# Altium schematic sheet BloopPadMaxx_01.SchDoc: BloopPad Maxx
size A3; Date: 11/09/2026; DrawnBy: Wim Van Gool; DocumentNumber: 1; Revision: 01; SheetNumber: 1; SheetTotal: 1
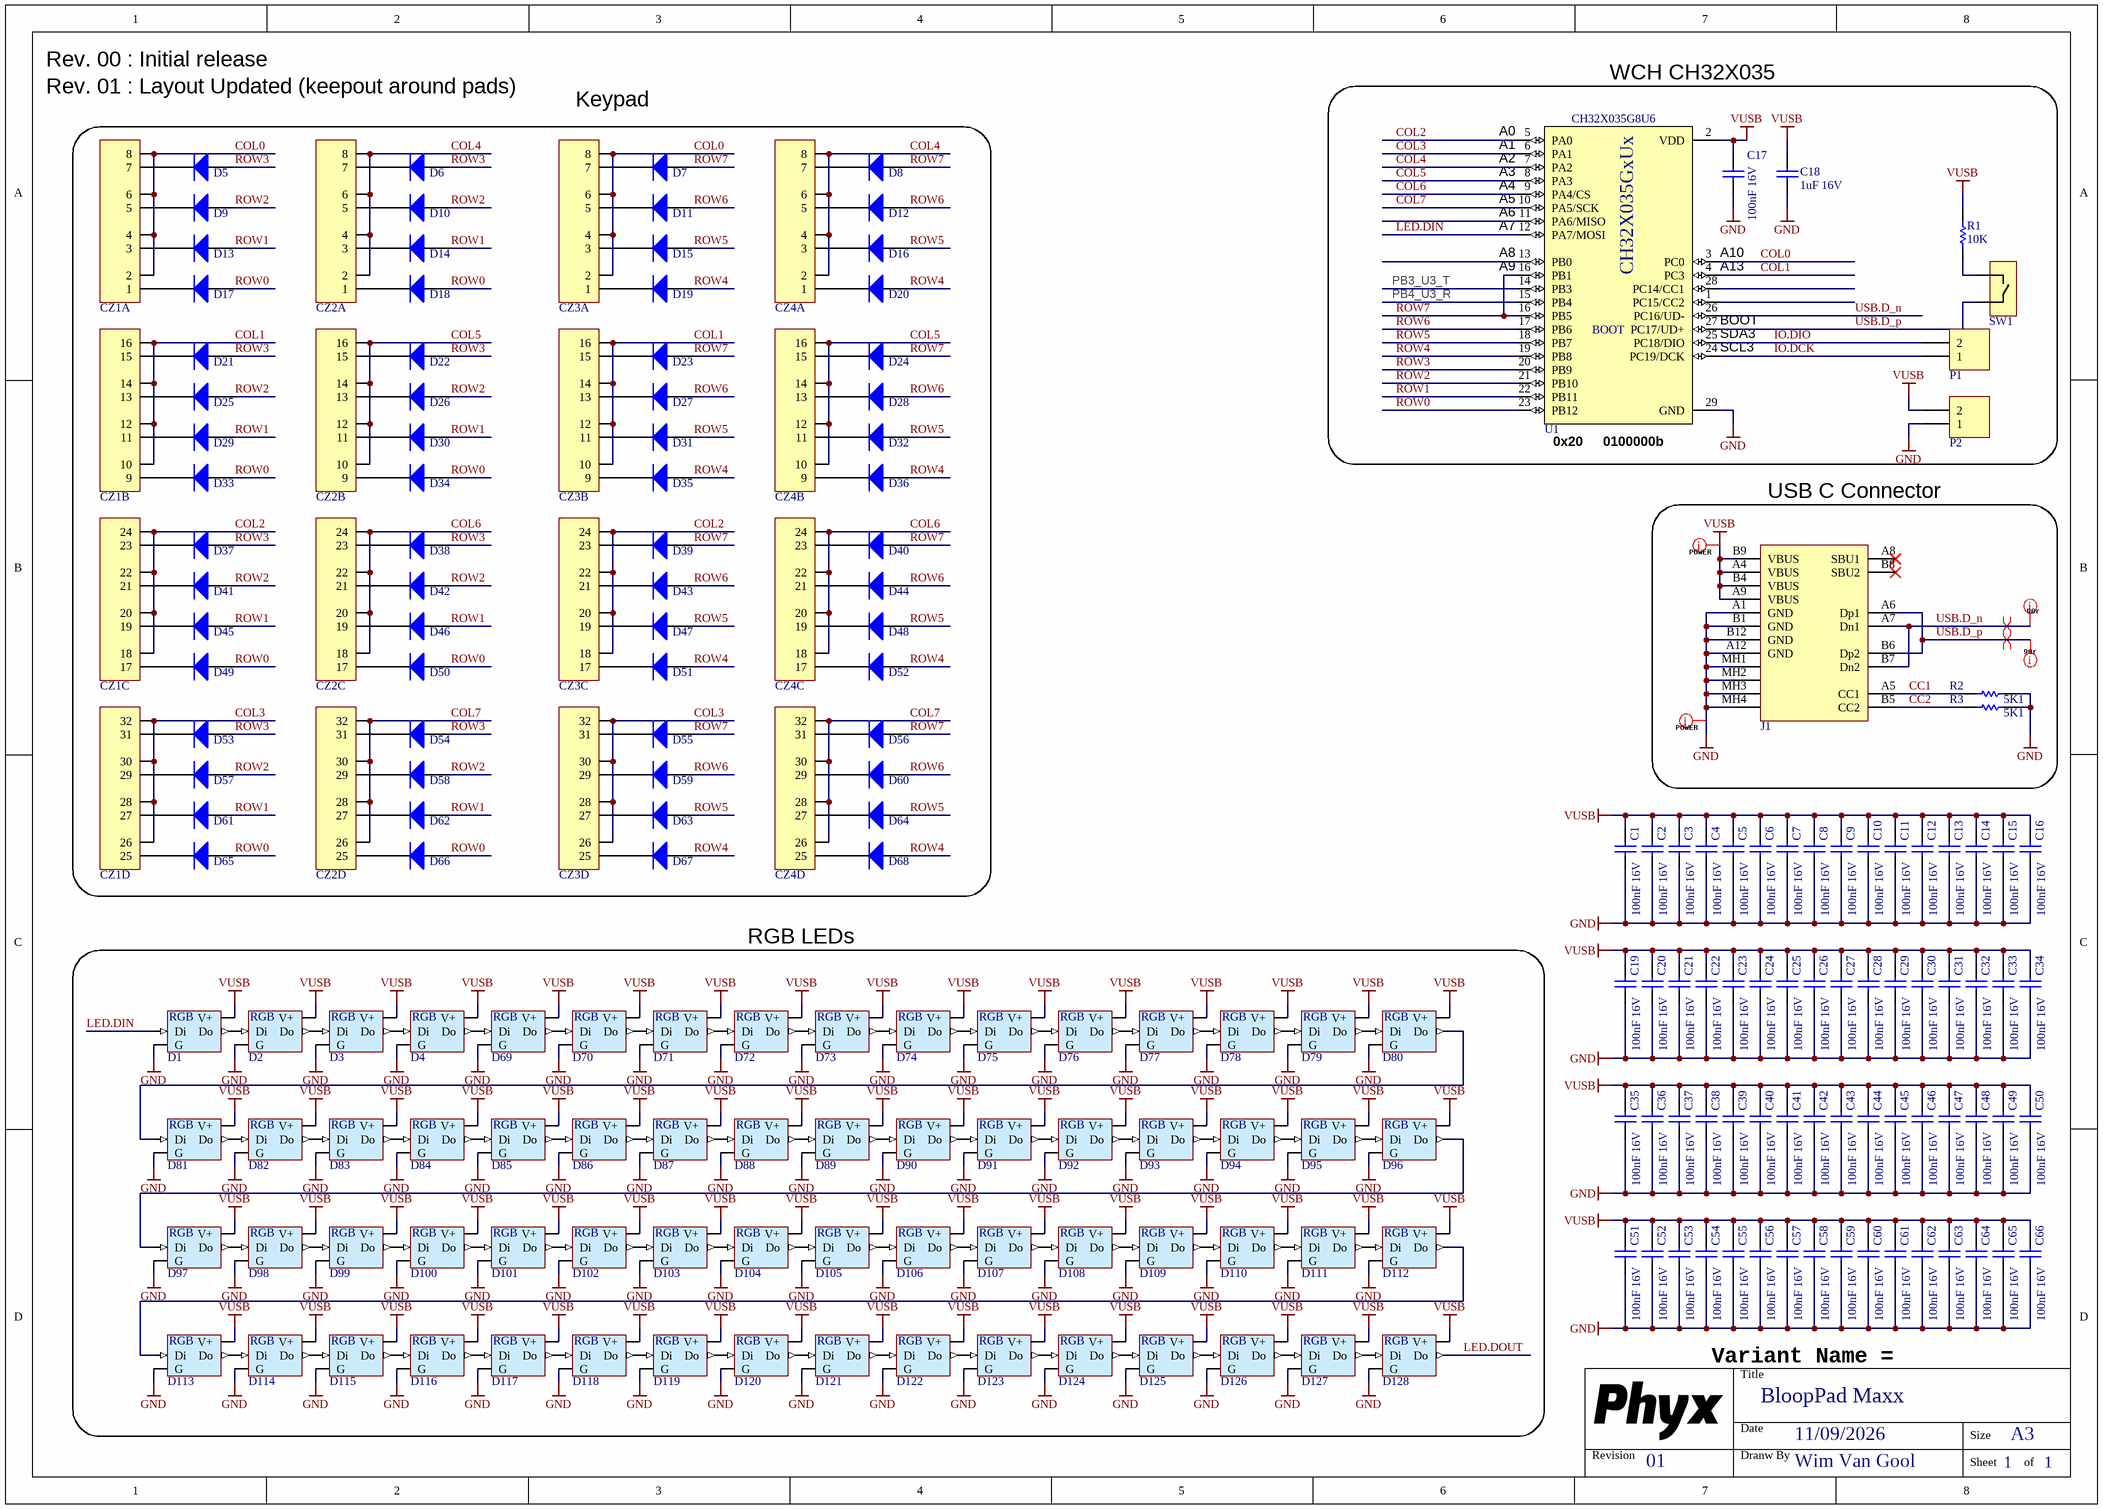
[diagram p0: BloopPadMaxx_01.SchDoc]

## Parts
C1  value 100nF 16V  [C0603_N]  (hidden comment: CAP_CERAMIC)
C2  value 100nF 16V  [C0603_N]  (hidden comment: CAP_CERAMIC)
C3  value 100nF 16V  [C0603_N]  (hidden comment: CAP_CERAMIC)
C4  value 100nF 16V  [C0603_N]  (hidden comment: CAP_CERAMIC)
C5  value 100nF 16V  [C0603_N]  (hidden comment: CAP_CERAMIC)
C6  value 100nF 16V  [C0603_N]  (hidden comment: CAP_CERAMIC)
C7  value 100nF 16V  [C0603_N]  (hidden comment: CAP_CERAMIC)
C8  value 100nF 16V  [C0603_N]  (hidden comment: CAP_CERAMIC)
C9  value 100nF 16V  [C0603_N]  (hidden comment: CAP_CERAMIC)
C10  value 100nF 16V  [C0603_N]  (hidden comment: CAP_CERAMIC)
C11  value 100nF 16V  [C0603_N]  (hidden comment: CAP_CERAMIC)
C12  value 100nF 16V  [C0603_N]  (hidden comment: CAP_CERAMIC)
C13  value 100nF 16V  [C0603_N]  (hidden comment: CAP_CERAMIC)
C14  value 100nF 16V  [C0603_N]  (hidden comment: CAP_CERAMIC)
C15  value 100nF 16V  [C0603_N]  (hidden comment: CAP_CERAMIC)
C16  value 100nF 16V  [C0603_N]  (hidden comment: CAP_CERAMIC)
C17  value 100nF 16V  [C0603_N]
C18  value 1uF 16V  [C0603_N]
C19  value 100nF 16V  [C0603_N]  (hidden comment: CAP_CERAMIC)
C20  value 100nF 16V  [C0603_N]  (hidden comment: CAP_CERAMIC)
C21  value 100nF 16V  [C0603_N]  (hidden comment: CAP_CERAMIC)
C22  value 100nF 16V  [C0603_N]  (hidden comment: CAP_CERAMIC)
C23  value 100nF 16V  [C0603_N]  (hidden comment: CAP_CERAMIC)
C24  value 100nF 16V  [C0603_N]  (hidden comment: CAP_CERAMIC)
C25  value 100nF 16V  [C0603_N]  (hidden comment: CAP_CERAMIC)
C26  value 100nF 16V  [C0603_N]  (hidden comment: CAP_CERAMIC)
C27  value 100nF 16V  [C0603_N]  (hidden comment: CAP_CERAMIC)
C28  value 100nF 16V  [C0603_N]  (hidden comment: CAP_CERAMIC)
C29  value 100nF 16V  [C0603_N]  (hidden comment: CAP_CERAMIC)
C30  value 100nF 16V  [C0603_N]  (hidden comment: CAP_CERAMIC)
C31  value 100nF 16V  [C0603_N]  (hidden comment: CAP_CERAMIC)
C32  value 100nF 16V  [C0603_N]  (hidden comment: CAP_CERAMIC)
C33  value 100nF 16V  [C0603_N]  (hidden comment: CAP_CERAMIC)
C34  value 100nF 16V  [C0603_N]  (hidden comment: CAP_CERAMIC)
C35  value 100nF 16V  [C0603_N]  (hidden comment: CAP_CERAMIC)
C36  value 100nF 16V  [C0603_N]  (hidden comment: CAP_CERAMIC)
C37  value 100nF 16V  [C0603_N]  (hidden comment: CAP_CERAMIC)
C38  value 100nF 16V  [C0603_N]  (hidden comment: CAP_CERAMIC)
C39  value 100nF 16V  [C0603_N]  (hidden comment: CAP_CERAMIC)
C40  value 100nF 16V  [C0603_N]  (hidden comment: CAP_CERAMIC)
C41  value 100nF 16V  [C0603_N]  (hidden comment: CAP_CERAMIC)
C42  value 100nF 16V  [C0603_N]  (hidden comment: CAP_CERAMIC)
C43  value 100nF 16V  [C0603_N]  (hidden comment: CAP_CERAMIC)
C44  value 100nF 16V  [C0603_N]  (hidden comment: CAP_CERAMIC)
C45  value 100nF 16V  [C0603_N]  (hidden comment: CAP_CERAMIC)
C46  value 100nF 16V  [C0603_N]  (hidden comment: CAP_CERAMIC)
C47  value 100nF 16V  [C0603_N]  (hidden comment: CAP_CERAMIC)
C48  value 100nF 16V  [C0603_N]  (hidden comment: CAP_CERAMIC)
C49  value 100nF 16V  [C0603_N]  (hidden comment: CAP_CERAMIC)
C50  value 100nF 16V  [C0603_N]  (hidden comment: CAP_CERAMIC)
C51  value 100nF 16V  [C0603_N]  (hidden comment: CAP_CERAMIC)
C52  value 100nF 16V  [C0603_N]  (hidden comment: CAP_CERAMIC)
C53  value 100nF 16V  [C0603_N]  (hidden comment: CAP_CERAMIC)
C54  value 100nF 16V  [C0603_N]  (hidden comment: CAP_CERAMIC)
C55  value 100nF 16V  [C0603_N]  (hidden comment: CAP_CERAMIC)
C56  value 100nF 16V  [C0603_N]  (hidden comment: CAP_CERAMIC)
C57  value 100nF 16V  [C0603_N]  (hidden comment: CAP_CERAMIC)
C58  value 100nF 16V  [C0603_N]  (hidden comment: CAP_CERAMIC)
C59  value 100nF 16V  [C0603_N]  (hidden comment: CAP_CERAMIC)
C60  value 100nF 16V  [C0603_N]  (hidden comment: CAP_CERAMIC)
C61  value 100nF 16V  [C0603_N]  (hidden comment: CAP_CERAMIC)
C62  value 100nF 16V  [C0603_N]  (hidden comment: CAP_CERAMIC)
C63  value 100nF 16V  [C0603_N]  (hidden comment: CAP_CERAMIC)
C64  value 100nF 16V  [C0603_N]  (hidden comment: CAP_CERAMIC)
C65  value 100nF 16V  [C0603_N]  (hidden comment: CAP_CERAMIC)
C66  value 100nF 16V  [C0603_N]  (hidden comment: CAP_CERAMIC)
CZ1  Campzone 2020 4x4 silicone keypad  [CZ20_4x4]  (value not drawn)  (parts A,B,C,D of 4)
CZ2  Campzone 2020 4x4 silicone keypad  [CZ20_4x4]  (value not drawn)  (parts A,B,C,D of 4)
CZ3  Campzone 2020 4x4 silicone keypad  [CZ20_4x4]  (value not drawn)  (parts A,B,C,D of 4)
CZ4  Campzone 2020 4x4 silicone keypad  [CZ20_4x4]  (value not drawn)  (parts A,B,C,D of 4)
D1  WS2812 based digital RGB LED 2022 package  [LED_2022_WS2812B]  (value not drawn)
D2  WS2812 based digital RGB LED 2022 package  [LED_2022_WS2812B]  (value not drawn)
D3  WS2812 based digital RGB LED 2022 package  [LED_2022_WS2812B]  (value not drawn)
D4  WS2812 based digital RGB LED 2022 package  [LED_2022_WS2812B]  (value not drawn)
D5  1N4148W 75V 200mA 1.25Vf@150mA  [SOD-323_AC]  (value not drawn)
D6  1N4148W 75V 200mA 1.25Vf@150mA  [SOD-323_AC]  (value not drawn)
D7  1N4148W 75V 200mA 1.25Vf@150mA  [SOD-323_AC]  (value not drawn)
D8  1N4148W 75V 200mA 1.25Vf@150mA  [SOD-323_AC]  (value not drawn)
D9  1N4148W 75V 200mA 1.25Vf@150mA  [SOD-323_AC]  (value not drawn)
D10  1N4148W 75V 200mA 1.25Vf@150mA  [SOD-323_AC]  (value not drawn)
D11  1N4148W 75V 200mA 1.25Vf@150mA  [SOD-323_AC]  (value not drawn)
D12  1N4148W 75V 200mA 1.25Vf@150mA  [SOD-323_AC]  (value not drawn)
D13  1N4148W 75V 200mA 1.25Vf@150mA  [SOD-323_AC]  (value not drawn)
D14  1N4148W 75V 200mA 1.25Vf@150mA  [SOD-323_AC]  (value not drawn)
D15  1N4148W 75V 200mA 1.25Vf@150mA  [SOD-323_AC]  (value not drawn)
D16  1N4148W 75V 200mA 1.25Vf@150mA  [SOD-323_AC]  (value not drawn)
D17  1N4148W 75V 200mA 1.25Vf@150mA  [SOD-323_AC]  (value not drawn)
D18  1N4148W 75V 200mA 1.25Vf@150mA  [SOD-323_AC]  (value not drawn)
D19  1N4148W 75V 200mA 1.25Vf@150mA  [SOD-323_AC]  (value not drawn)
D20  1N4148W 75V 200mA 1.25Vf@150mA  [SOD-323_AC]  (value not drawn)
D21  1N4148W 75V 200mA 1.25Vf@150mA  [SOD-323_AC]  (value not drawn)
D22  1N4148W 75V 200mA 1.25Vf@150mA  [SOD-323_AC]  (value not drawn)
D23  1N4148W 75V 200mA 1.25Vf@150mA  [SOD-323_AC]  (value not drawn)
D24  1N4148W 75V 200mA 1.25Vf@150mA  [SOD-323_AC]  (value not drawn)
D25  1N4148W 75V 200mA 1.25Vf@150mA  [SOD-323_AC]  (value not drawn)
D26  1N4148W 75V 200mA 1.25Vf@150mA  [SOD-323_AC]  (value not drawn)
D27  1N4148W 75V 200mA 1.25Vf@150mA  [SOD-323_AC]  (value not drawn)
D28  1N4148W 75V 200mA 1.25Vf@150mA  [SOD-323_AC]  (value not drawn)
D29  1N4148W 75V 200mA 1.25Vf@150mA  [SOD-323_AC]  (value not drawn)
D30  1N4148W 75V 200mA 1.25Vf@150mA  [SOD-323_AC]  (value not drawn)
D31  1N4148W 75V 200mA 1.25Vf@150mA  [SOD-323_AC]  (value not drawn)
D32  1N4148W 75V 200mA 1.25Vf@150mA  [SOD-323_AC]  (value not drawn)
D33  1N4148W 75V 200mA 1.25Vf@150mA  [SOD-323_AC]  (value not drawn)
D34  1N4148W 75V 200mA 1.25Vf@150mA  [SOD-323_AC]  (value not drawn)
D35  1N4148W 75V 200mA 1.25Vf@150mA  [SOD-323_AC]  (value not drawn)
D36  1N4148W 75V 200mA 1.25Vf@150mA  [SOD-323_AC]  (value not drawn)
D37  1N4148W 75V 200mA 1.25Vf@150mA  [SOD-323_AC]  (value not drawn)
D38  1N4148W 75V 200mA 1.25Vf@150mA  [SOD-323_AC]  (value not drawn)
D39  1N4148W 75V 200mA 1.25Vf@150mA  [SOD-323_AC]  (value not drawn)
D40  1N4148W 75V 200mA 1.25Vf@150mA  [SOD-323_AC]  (value not drawn)
D41  1N4148W 75V 200mA 1.25Vf@150mA  [SOD-323_AC]  (value not drawn)
D42  1N4148W 75V 200mA 1.25Vf@150mA  [SOD-323_AC]  (value not drawn)
D43  1N4148W 75V 200mA 1.25Vf@150mA  [SOD-323_AC]  (value not drawn)
D44  1N4148W 75V 200mA 1.25Vf@150mA  [SOD-323_AC]  (value not drawn)
D45  1N4148W 75V 200mA 1.25Vf@150mA  [SOD-323_AC]  (value not drawn)
D46  1N4148W 75V 200mA 1.25Vf@150mA  [SOD-323_AC]  (value not drawn)
D47  1N4148W 75V 200mA 1.25Vf@150mA  [SOD-323_AC]  (value not drawn)
D48  1N4148W 75V 200mA 1.25Vf@150mA  [SOD-323_AC]  (value not drawn)
D49  1N4148W 75V 200mA 1.25Vf@150mA  [SOD-323_AC]  (value not drawn)
D50  1N4148W 75V 200mA 1.25Vf@150mA  [SOD-323_AC]  (value not drawn)
D51  1N4148W 75V 200mA 1.25Vf@150mA  [SOD-323_AC]  (value not drawn)
D52  1N4148W 75V 200mA 1.25Vf@150mA  [SOD-323_AC]  (value not drawn)
D53  1N4148W 75V 200mA 1.25Vf@150mA  [SOD-323_AC]  (value not drawn)
D54  1N4148W 75V 200mA 1.25Vf@150mA  [SOD-323_AC]  (value not drawn)
D55  1N4148W 75V 200mA 1.25Vf@150mA  [SOD-323_AC]  (value not drawn)
D56  1N4148W 75V 200mA 1.25Vf@150mA  [SOD-323_AC]  (value not drawn)
D57  1N4148W 75V 200mA 1.25Vf@150mA  [SOD-323_AC]  (value not drawn)
D58  1N4148W 75V 200mA 1.25Vf@150mA  [SOD-323_AC]  (value not drawn)
D59  1N4148W 75V 200mA 1.25Vf@150mA  [SOD-323_AC]  (value not drawn)
D60  1N4148W 75V 200mA 1.25Vf@150mA  [SOD-323_AC]  (value not drawn)
D61  1N4148W 75V 200mA 1.25Vf@150mA  [SOD-323_AC]  (value not drawn)
D62  1N4148W 75V 200mA 1.25Vf@150mA  [SOD-323_AC]  (value not drawn)
D63  1N4148W 75V 200mA 1.25Vf@150mA  [SOD-323_AC]  (value not drawn)
D64  1N4148W 75V 200mA 1.25Vf@150mA  [SOD-323_AC]  (value not drawn)
D65  1N4148W 75V 200mA 1.25Vf@150mA  [SOD-323_AC]  (value not drawn)
D66  1N4148W 75V 200mA 1.25Vf@150mA  [SOD-323_AC]  (value not drawn)
D67  1N4148W 75V 200mA 1.25Vf@150mA  [SOD-323_AC]  (value not drawn)
D68  1N4148W 75V 200mA 1.25Vf@150mA  [SOD-323_AC]  (value not drawn)
D69  WS2812 based digital RGB LED 2022 package  [LED_2022_WS2812B]  (value not drawn)
D70  WS2812 based digital RGB LED 2022 package  [LED_2022_WS2812B]  (value not drawn)
D71  WS2812 based digital RGB LED 2022 package  [LED_2022_WS2812B]  (value not drawn)
D72  WS2812 based digital RGB LED 2022 package  [LED_2022_WS2812B]  (value not drawn)
D73  WS2812 based digital RGB LED 2022 package  [LED_2022_WS2812B]  (value not drawn)
D74  WS2812 based digital RGB LED 2022 package  [LED_2022_WS2812B]  (value not drawn)
D75  WS2812 based digital RGB LED 2022 package  [LED_2022_WS2812B]  (value not drawn)
D76  WS2812 based digital RGB LED 2022 package  [LED_2022_WS2812B]  (value not drawn)
D77  WS2812 based digital RGB LED 2022 package  [LED_2022_WS2812B]  (value not drawn)
D78  WS2812 based digital RGB LED 2022 package  [LED_2022_WS2812B]  (value not drawn)
D79  WS2812 based digital RGB LED 2022 package  [LED_2022_WS2812B]  (value not drawn)
D80  WS2812 based digital RGB LED 2022 package  [LED_2022_WS2812B]  (value not drawn)
D81  WS2812 based digital RGB LED 2022 package  [LED_2022_WS2812B]  (value not drawn)
D82  WS2812 based digital RGB LED 2022 package  [LED_2022_WS2812B]  (value not drawn)
D83  WS2812 based digital RGB LED 2022 package  [LED_2022_WS2812B]  (value not drawn)
D84  WS2812 based digital RGB LED 2022 package  [LED_2022_WS2812B]  (value not drawn)
D85  WS2812 based digital RGB LED 2022 package  [LED_2022_WS2812B]  (value not drawn)
D86  WS2812 based digital RGB LED 2022 package  [LED_2022_WS2812B]  (value not drawn)
D87  WS2812 based digital RGB LED 2022 package  [LED_2022_WS2812B]  (value not drawn)
D88  WS2812 based digital RGB LED 2022 package  [LED_2022_WS2812B]  (value not drawn)
D89  WS2812 based digital RGB LED 2022 package  [LED_2022_WS2812B]  (value not drawn)
D90  WS2812 based digital RGB LED 2022 package  [LED_2022_WS2812B]  (value not drawn)
D91  WS2812 based digital RGB LED 2022 package  [LED_2022_WS2812B]  (value not drawn)
D92  WS2812 based digital RGB LED 2022 package  [LED_2022_WS2812B]  (value not drawn)
D93  WS2812 based digital RGB LED 2022 package  [LED_2022_WS2812B]  (value not drawn)
D94  WS2812 based digital RGB LED 2022 package  [LED_2022_WS2812B]  (value not drawn)
D95  WS2812 based digital RGB LED 2022 package  [LED_2022_WS2812B]  (value not drawn)
D96  WS2812 based digital RGB LED 2022 package  [LED_2022_WS2812B]  (value not drawn)
D97  WS2812 based digital RGB LED 2022 package  [LED_2022_WS2812B]  (value not drawn)
D98  WS2812 based digital RGB LED 2022 package  [LED_2022_WS2812B]  (value not drawn)
D99  WS2812 based digital RGB LED 2022 package  [LED_2022_WS2812B]  (value not drawn)
D100  WS2812 based digital RGB LED 2022 package  [LED_2022_WS2812B]  (value not drawn)
D101  WS2812 based digital RGB LED 2022 package  [LED_2022_WS2812B]  (value not drawn)
D102  WS2812 based digital RGB LED 2022 package  [LED_2022_WS2812B]  (value not drawn)
D103  WS2812 based digital RGB LED 2022 package  [LED_2022_WS2812B]  (value not drawn)
D104  WS2812 based digital RGB LED 2022 package  [LED_2022_WS2812B]  (value not drawn)
D105  WS2812 based digital RGB LED 2022 package  [LED_2022_WS2812B]  (value not drawn)
D106  WS2812 based digital RGB LED 2022 package  [LED_2022_WS2812B]  (value not drawn)
D107  WS2812 based digital RGB LED 2022 package  [LED_2022_WS2812B]  (value not drawn)
D108  WS2812 based digital RGB LED 2022 package  [LED_2022_WS2812B]  (value not drawn)
D109  WS2812 based digital RGB LED 2022 package  [LED_2022_WS2812B]  (value not drawn)
D110  WS2812 based digital RGB LED 2022 package  [LED_2022_WS2812B]  (value not drawn)
D111  WS2812 based digital RGB LED 2022 package  [LED_2022_WS2812B]  (value not drawn)
D112  WS2812 based digital RGB LED 2022 package  [LED_2022_WS2812B]  (value not drawn)
D113  WS2812 based digital RGB LED 2022 package  [LED_2022_WS2812B]  (value not drawn)
D114  WS2812 based digital RGB LED 2022 package  [LED_2022_WS2812B]  (value not drawn)
D115  WS2812 based digital RGB LED 2022 package  [LED_2022_WS2812B]  (value not drawn)
D116  WS2812 based digital RGB LED 2022 package  [LED_2022_WS2812B]  (value not drawn)
D117  WS2812 based digital RGB LED 2022 package  [LED_2022_WS2812B]  (value not drawn)
D118  WS2812 based digital RGB LED 2022 package  [LED_2022_WS2812B]  (value not drawn)
D119  WS2812 based digital RGB LED 2022 package  [LED_2022_WS2812B]  (value not drawn)
D120  WS2812 based digital RGB LED 2022 package  [LED_2022_WS2812B]  (value not drawn)
D121  WS2812 based digital RGB LED 2022 package  [LED_2022_WS2812B]  (value not drawn)
D122  WS2812 based digital RGB LED 2022 package  [LED_2022_WS2812B]  (value not drawn)
D123  WS2812 based digital RGB LED 2022 package  [LED_2022_WS2812B]  (value not drawn)
D124  WS2812 based digital RGB LED 2022 package  [LED_2022_WS2812B]  (value not drawn)
D125  WS2812 based digital RGB LED 2022 package  [LED_2022_WS2812B]  (value not drawn)
D126  WS2812 based digital RGB LED 2022 package  [LED_2022_WS2812B]  (value not drawn)
D127  WS2812 based digital RGB LED 2022 package  [LED_2022_WS2812B]  (value not drawn)
D128  WS2812 based digital RGB LED 2022 package  [LED_2022_WS2812B]  (value not drawn)
J1  USB 2.0 C Reversible Receptacle Horizontal full SMD  [XUNPU-TYPEC-304S-ACP16]  (value not drawn)
P1  Header 2  [HDR1X2]  (value not drawn)
P2  Header 2  [HDR1X2]  (value not drawn)
R1  value 10K  [R0603_N]
R2  value 5K1  [R0603_N]
R3  value 5K1  [R0603_N]
SW1  LP SMD tact sw 3x2.5mm  [OMR_B3U-1000P]  (value not drawn)
U1  value CH32X035G8U6  [QFN_28_4.0x4.0_P0.4]  (hidden comment: WCH CH32X035G8U6 QFN28 RISC-V 32-bit MCU, 62KB Flash, 10KB RAM, USB PD)

## Blocks framed on the sheet
Keypad: CZ1-CZ4 D5-D68
WCH CH32X035: C17 C18 P1 P2 R1 SW1 U1
USB C Connector: J1 R2 R3
RGB LEDs: D1-D4 D69-D128

## Nets
GND: C1.2 C2.2 C3.2 C4.2 C5.2 C6.2 C7.2 C8.2 C9.2 C10.2 C11.2 C12.2 C13.2 C14.2 C15.2 C16.2 C17.2 C18.2 C19.2 C20.2 C21.2 C22.2 C23.2 C24.2 C25.2 C26.2 C27.2 C28.2 C29.2 C30.2 C31.2 C32.2 C33.2 C34.2 C35.2 C36.2 C37.2 C38.2 C39.2 C40.2 C41.2 C42.2 C43.2 C44.2 C45.2 C46.2 C47.2 C48.2 C49.2 C50.2 C51.2 C52.2 C53.2 C54.2 C55.2 C56.2 C57.2 C58.2 C59.2 C60.2 C61.2 C62.2 C63.2 C64.2 C65.2 C66.2 D1.2(G) D2.2(G) D3.2(G) D4.2(G) D69.2(G) D70.2(G) D71.2(G) D72.2(G) D73.2(G) D74.2(G) D75.2(G) D76.2(G) D77.2(G) D78.2(G) D79.2(G) D80.2(G) D81.2(G) D82.2(G) D83.2(G) D84.2(G) D85.2(G) D86.2(G) D87.2(G) D88.2(G) D89.2(G) D90.2(G) D91.2(G) D92.2(G) D93.2(G) D94.2(G) D95.2(G) D96.2(G) D97.2(G) D98.2(G) D99.2(G) D100.2(G) D101.2(G) D102.2(G) D103.2(G) D104.2(G) D105.2(G) D106.2(G) D107.2(G) D108.2(G) D109.2(G) D110.2(G) D111.2(G) D112.2(G) D113.2(G) D114.2(G) D115.2(G) D116.2(G) D117.2(G) D118.2(G) D119.2(G) D120.2(G) D121.2(G) D122.2(G) D123.2(G) D124.2(G) D125.2(G) D126.2(G) D127.2(G) D128.2(G) J1.A1(GND) J1.A12(GND) J1.B1(GND) J1.B12(GND) J1.MH1(Tab) J1.MH2(Tab) J1.MH3(Tab) J1.MH4(Tab) P2.1 R2.2 R3.2 U1.29(GND)
VUSB: C1.1 C2.1 C3.1 C4.1 C5.1 C6.1 C7.1 C8.1 C9.1 C10.1 C11.1 C12.1 C13.1 C14.1 C15.1 C16.1 C17.1 C18.1 C19.1 C20.1 C21.1 C22.1 C23.1 C24.1 C25.1 C26.1 C27.1 C28.1 C29.1 C30.1 C31.1 C32.1 C33.1 C34.1 C35.1 C36.1 C37.1 C38.1 C39.1 C40.1 C41.1 C42.1 C43.1 C44.1 C45.1 C46.1 C47.1 C48.1 C49.1 C50.1 C51.1 C52.1 C53.1 C54.1 C55.1 C56.1 C57.1 C58.1 C59.1 C60.1 C61.1 C62.1 C63.1 C64.1 C65.1 C66.1 D1.4(V+) D2.4(V+) D3.4(V+) D4.4(V+) D69.4(V+) D70.4(V+) D71.4(V+) D72.4(V+) D73.4(V+) D74.4(V+) D75.4(V+) D76.4(V+) D77.4(V+) D78.4(V+) D79.4(V+) D80.4(V+) D81.4(V+) D82.4(V+) D83.4(V+) D84.4(V+) D85.4(V+) D86.4(V+) D87.4(V+) D88.4(V+) D89.4(V+) D90.4(V+) D91.4(V+) D92.4(V+) D93.4(V+) D94.4(V+) D95.4(V+) D96.4(V+) D97.4(V+) D98.4(V+) D99.4(V+) D100.4(V+) D101.4(V+) D102.4(V+) D103.4(V+) D104.4(V+) D105.4(V+) D106.4(V+) D107.4(V+) D108.4(V+) D109.4(V+) D110.4(V+) D111.4(V+) D112.4(V+) D113.4(V+) D114.4(V+) D115.4(V+) D116.4(V+) D117.4(V+) D118.4(V+) D119.4(V+) D120.4(V+) D121.4(V+) D122.4(V+) D123.4(V+) D124.4(V+) D125.4(V+) D126.4(V+) D127.4(V+) D128.4(V+) J1.A4(VBUS) J1.A9(VBUS) J1.B4(VBUS) J1.B9(VBUS) P2.2 R1.1 U1.2(VDD)
CC1: J1.A5(CC1) R2.1
CC2: J1.B5(CC2) R3.1
COL0: CZ1.2 CZ1.4 CZ1.6 CZ1.8 CZ3.2 CZ3.4 CZ3.6 CZ3.8 U1.3(PC0)
COL1: CZ1.10 CZ1.12 CZ1.14 CZ1.16 CZ3.10 CZ3.12 CZ3.14 CZ3.16 U1.4(PC3)
COL2: CZ1.18 CZ1.20 CZ1.22 CZ1.24 CZ3.18 CZ3.20 CZ3.22 CZ3.24 U1.5(PA0)
COL3: CZ1.26 CZ1.28 CZ1.30 CZ1.32 CZ3.26 CZ3.28 CZ3.30 CZ3.32 U1.6(PA1)
COL4: CZ2.2 CZ2.4 CZ2.6 CZ2.8 CZ4.2 CZ4.4 CZ4.6 CZ4.8 U1.7(PA2)
COL5: CZ2.10 CZ2.12 CZ2.14 CZ2.16 CZ4.10 CZ4.12 CZ4.14 CZ4.16 U1.8(PA3)
COL6: CZ2.18 CZ2.20 CZ2.22 CZ2.24 CZ4.18 CZ4.20 CZ4.22 CZ4.24 U1.9(PA4/CS)
COL7: CZ2.26 CZ2.28 CZ2.30 CZ2.32 CZ4.26 CZ4.28 CZ4.30 CZ4.32 U1.10(PA5/SCK)
IO.DCK: P1.1 U1.24(PC19/DCK)
IO.DIO: P1.2 U1.25(PC18/DIO)
LED.DIN: D1.3(Di) U1.12(PA7/MOSI)
LED.DOUT: D128.1(Do)
ROW0: D17.A D18.A D33.A D34.A D49.A D50.A D65.A D66.A U1.23(PB12)
ROW1: D13.A D14.A D29.A D30.A D45.A D46.A D61.A D62.A U1.22(PB11)
ROW2: D9.A D10.A D25.A D26.A D41.A D42.A D57.A D58.A U1.21(PB10)
ROW3: D5.A D6.A D21.A D22.A D37.A D38.A D53.A D54.A U1.20(PB9)
ROW4: D19.A D20.A D35.A D36.A D51.A D52.A D67.A D68.A U1.19(PB8)
ROW5: D15.A D16.A D31.A D32.A D47.A D48.A D63.A D64.A U1.18(PB7)
ROW6: D11.A D12.A D27.A D28.A D43.A D44.A D59.A D60.A U1.17(PB6)
ROW7: D7.A D8.A D23.A D24.A D39.A D40.A D55.A D56.A U1.16(PB1)
USB.D_n: J1.A7(Dn1) J1.B7(Dn2) U1.26(PC16/UD-)
USB.D_p: J1.A6(Dp1) J1.B6(Dp2) SW1.2 U1.27(PC17/UD+)
NetCZ1_1: CZ1.1 D17.C
NetCZ1_3: CZ1.3 D13.C
NetCZ1_5: CZ1.5 D9.C
NetCZ1_7: CZ1.7 D5.C
NetCZ1_9: CZ1.9 D33.C
NetCZ1_11: CZ1.11 D29.C
NetCZ1_13: CZ1.13 D25.C
NetCZ1_15: CZ1.15 D21.C
NetCZ1_17: CZ1.17 D49.C
NetCZ1_19: CZ1.19 D45.C
NetCZ1_21: CZ1.21 D41.C
NetCZ1_23: CZ1.23 D37.C
NetCZ1_25: CZ1.25 D65.C
NetCZ1_27: CZ1.27 D61.C
NetCZ1_29: CZ1.29 D57.C
NetCZ1_31: CZ1.31 D53.C
NetCZ2_1: CZ2.1 D18.C
NetCZ2_3: CZ2.3 D14.C
NetCZ2_5: CZ2.5 D10.C
NetCZ2_7: CZ2.7 D6.C
NetCZ2_9: CZ2.9 D34.C
NetCZ2_11: CZ2.11 D30.C
NetCZ2_13: CZ2.13 D26.C
NetCZ2_15: CZ2.15 D22.C
NetCZ2_17: CZ2.17 D50.C
NetCZ2_19: CZ2.19 D46.C
NetCZ2_21: CZ2.21 D42.C
NetCZ2_23: CZ2.23 D38.C
NetCZ2_25: CZ2.25 D66.C
NetCZ2_27: CZ2.27 D62.C
NetCZ2_29: CZ2.29 D58.C
NetCZ2_31: CZ2.31 D54.C
NetCZ3_1: CZ3.1 D19.C
NetCZ3_3: CZ3.3 D15.C
NetCZ3_5: CZ3.5 D11.C
NetCZ3_7: CZ3.7 D7.C
NetCZ3_9: CZ3.9 D35.C
NetCZ3_11: CZ3.11 D31.C
NetCZ3_13: CZ3.13 D27.C
NetCZ3_15: CZ3.15 D23.C
NetCZ3_17: CZ3.17 D51.C
NetCZ3_19: CZ3.19 D47.C
NetCZ3_21: CZ3.21 D43.C
NetCZ3_23: CZ3.23 D39.C
NetCZ3_25: CZ3.25 D67.C
NetCZ3_27: CZ3.27 D63.C
NetCZ3_29: CZ3.29 D59.C
NetCZ3_31: CZ3.31 D55.C
NetCZ4_1: CZ4.1 D20.C
NetCZ4_3: CZ4.3 D16.C
NetCZ4_5: CZ4.5 D12.C
NetCZ4_7: CZ4.7 D8.C
NetCZ4_9: CZ4.9 D36.C
NetCZ4_11: CZ4.11 D32.C
NetCZ4_13: CZ4.13 D28.C
NetCZ4_15: CZ4.15 D24.C
NetCZ4_17: CZ4.17 D52.C
NetCZ4_19: CZ4.19 D48.C
NetCZ4_21: CZ4.21 D44.C
NetCZ4_23: CZ4.23 D40.C
NetCZ4_25: CZ4.25 D68.C
NetCZ4_27: CZ4.27 D64.C
NetCZ4_29: CZ4.29 D60.C
NetCZ4_31: CZ4.31 D56.C
NetD1_1: D1.1(Do) D2.3(Di)
NetD2_1: D2.1(Do) D3.3(Di)
NetD3_1: D3.1(Do) D4.3(Di)
NetD4_1: D4.1(Do) D69.3(Di)
NetD69_1: D69.1(Do) D70.3(Di)
NetD70_1: D70.1(Do) D71.3(Di)
NetD71_1: D71.1(Do) D72.3(Di)
NetD72_1: D72.1(Do) D73.3(Di)
NetD73_1: D73.1(Do) D74.3(Di)
NetD74_1: D74.1(Do) D75.3(Di)
NetD75_1: D75.1(Do) D76.3(Di)
NetD76_1: D76.1(Do) D77.3(Di)
NetD77_1: D77.1(Do) D78.3(Di)
NetD78_1: D78.1(Do) D79.3(Di)
NetD79_1: D79.1(Do) D80.3(Di)
NetD80_1: D80.1(Do) D81.3(Di)
NetD81_1: D81.1(Do) D82.3(Di)
NetD82_1: D82.1(Do) D83.3(Di)
NetD83_1: D83.1(Do) D84.3(Di)
NetD84_1: D84.1(Do) D85.3(Di)
NetD85_1: D85.1(Do) D86.3(Di)
NetD86_1: D86.1(Do) D87.3(Di)
NetD87_1: D87.1(Do) D88.3(Di)
NetD88_1: D88.1(Do) D89.3(Di)
NetD89_1: D89.1(Do) D90.3(Di)
NetD90_1: D90.1(Do) D91.3(Di)
NetD91_1: D91.1(Do) D92.3(Di)
NetD92_1: D92.1(Do) D93.3(Di)
NetD93_1: D93.1(Do) D94.3(Di)
NetD94_1: D94.1(Do) D95.3(Di)
NetD95_1: D95.1(Do) D96.3(Di)
NetD96_1: D96.1(Do) D97.3(Di)
NetD97_1: D97.1(Do) D98.3(Di)
NetD98_1: D98.1(Do) D99.3(Di)
NetD99_1: D99.1(Do) D100.3(Di)
NetD100_1: D100.1(Do) D101.3(Di)
NetD101_1: D101.1(Do) D102.3(Di)
NetD102_1: D102.1(Do) D103.3(Di)
NetD103_1: D103.1(Do) D104.3(Di)
NetD104_1: D104.1(Do) D105.3(Di)
NetD105_1: D105.1(Do) D106.3(Di)
NetD106_1: D106.1(Do) D107.3(Di)
NetD107_1: D107.1(Do) D108.3(Di)
NetD108_1: D108.1(Do) D109.3(Di)
NetD109_1: D109.1(Do) D110.3(Di)
NetD110_1: D110.1(Do) D111.3(Di)
NetD111_1: D111.1(Do) D112.3(Di)
NetD112_1: D112.1(Do) D113.3(Di)
NetD113_1: D113.1(Do) D114.3(Di)
NetD114_1: D114.1(Do) D115.3(Di)
NetD115_1: D115.1(Do) D116.3(Di)
NetD116_1: D116.1(Do) D117.3(Di)
NetD117_1: D117.1(Do) D118.3(Di)
NetD118_1: D118.1(Do) D119.3(Di)
NetD119_1: D119.1(Do) D120.3(Di)
NetD120_1: D120.1(Do) D121.3(Di)
NetD121_1: D121.1(Do) D122.3(Di)
NetD122_1: D122.1(Do) D123.3(Di)
NetD123_1: D123.1(Do) D124.3(Di)
NetD124_1: D124.1(Do) D125.3(Di)
NetD125_1: D125.1(Do) D126.3(Di)
NetD126_1: D126.1(Do) D127.3(Di)
NetD127_1: D127.1(Do) D128.3(Di)
NetR1_2: R1.2 SW1.1

Not connected (* = marked no-connect by the designer): J1 A8(SBU1)* B8(SBU2)*; U1 1(PC15/CC2) 11(PA6/MISO) 13(PB0) 14(PB3) 15(PB4) 28(PC14/CC1)

## Layout directives
net class 90r: USB.D_n, USB.D_p
differential pair: USB.D_n, USB.D_p
net class POWER: GND, VUSB

## Notes on the sheet
- Rev. 00 : Initial release
- Rev. 01 : Layout Updated (keepout around pads)
- (near U1) A0
- (near U1) A1
- (near U1) A2
- (near U1) A3
- (near U1) A4
- (near U1) A5
- (near U1) A6
- (near U1) A7
- PB3_U3_T
- PB4_U3_R
- (near U1) A8
- (near U1) A9
- (near U1) A10
- (near U1) A13
- (near U1) BOOT
- (near U1) SCL3
- (near U1) SDA3
- (near U1) 0x20
- (near U1) 0100000b
- Variant Name =
- Title
- Revision
- Date
- Dranw By
- Size
- Sheet
- of
- (in symbol LED # RGB WS2812B-2022) RGB
- (in symbol RISCV # CH32X035G8U6) CH32X035GxUx; BOOT

## Library data of the parts
C1-C17 C19-C66 = CAP # 100nF 16V 0603: Capacitor Ceramic; Supplier 1: LCSC; Supplier Part Number 1: C282519; Supplier 3: Generic; Supplier Part Number 3: 100nF 16V 0603 X7R
C18 = CAP # 1uF 16V 0603: Capacitor Ceramic; Supplier 1: Farnell; Supplier Part Number 1: 2320814; Supplier 3: Generic; Supplier Part Number 3: 1uF 16V 0603 X7R; Supplier 2: LCSC; Supplier Part Number 2: C1592
CZ1-CZ4 = SW # CZ20 4x4: Value: CZ20 4x4; Supplier 1: STOCK
D1-D4 D69-D128 = LED # RGB WS2812B-2022: =Description; Value: WS2812B-2022; Supplier 1: LCSC; Supplier Part Number 1: C965555
D5-D68 = DIO # 1N4148W SOD-323: Default Diode; Value: 1N4148W; Supplier 1: LCSC; Supplier Part Number 1: C2904852; Supplier 2: LCSC; Supplier Part Number 2: C917117; Supplier 3: LCSC; Supplier Part Number 3: C909968
J1 = USB # C 2.0 RCPT TYPEC-304S-ACP16: Value: TYPEC-304S-ACP16; Supplier 1: LCSC; Supplier Part Number 1: C5187472; Supplier 2: LCSC; Supplier 3: LCSC; Supplier Part Number 2: C2927040; Supplier Part Number 3: C5156603
P1 P2 = Pin Header 2.54mm 2way: Supplier 1: LCSC; Supplier Part Number 1: C492401; Supplier 2: LCSC; Supplier Part Number 2: C541856
R1 = RES # 10K 0603: Supplier 3: Generic; Supplier Part Number 3: 10K 1% 0603; Supplier 1: Farnell; Supplier Part Number 1: 2502397; Supplier 2: LCSC; Supplier Part Number 2: C25804
R2 R3 = RES # 5K1 0603: Supplier 1: Farnell; Supplier Part Number 1: 2845922; Supplier 2: LCSC; Supplier 3: Generic; Supplier Part Number 2: C112314; Supplier Part Number 3: 5K1 1% 0603
SW1 = SW # TACT mini 3x2.5 mm B3U-1000P: Value: B3U-1000P; Supplier 1: LCSC; Supplier Part Number 1: C561514; Supplier 2: LCSC; Supplier Part Number 2: C231329; Supplier 3: Digi-Key; Supplier Part Number 3: SW1020CT-ND
U1 = RISCV # CH32X035G8U6: Supplier 1: LCSC; Supplier Part Number 1: C7437027